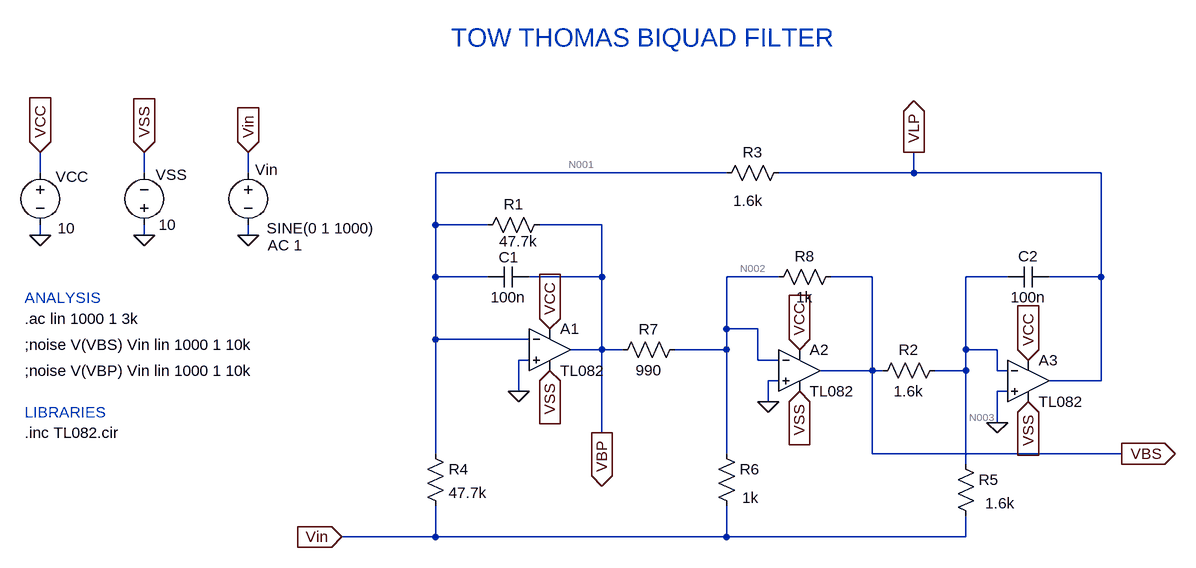
[diagram p0: schematic TTBiquad.asc]
TTBiquad.asc, the LTspice schematic file:
Version 4
SHEET 1 1612 680
WIRE -528 -96 -528 -128
WIRE -368 -96 -368 -128
WIRE -208 -96 -208 -128
WIRE 528 -96 80 -96
WIRE 816 -96 816 -128
WIRE 816 -96 608 -96
WIRE 1104 -96 816 -96
WIRE 80 -16 80 -96
WIRE 160 -16 80 -16
WIRE 336 -16 240 -16
WIRE -528 0 -528 -16
WIRE -368 0 -368 -16
WIRE -208 0 -208 -16
WIRE 80 64 80 -16
WIRE 160 64 80 64
WIRE 336 64 336 -16
WIRE 336 64 224 64
WIRE 608 64 528 64
WIRE 752 64 688 64
WIRE 960 64 896 64
WIRE 1104 64 1104 -96
WIRE 1104 64 1024 64
WIRE 528 144 528 64
WIRE 576 144 528 144
WIRE 80 160 80 64
WIRE 224 160 80 160
WIRE 256 160 256 144
WIRE 336 176 336 64
WIRE 336 176 288 176
WIRE 368 176 336 176
WIRE 528 176 528 144
WIRE 528 176 448 176
WIRE 896 176 896 64
WIRE 944 176 896 176
WIRE 224 192 208 192
WIRE 576 192 576 144
WIRE 608 192 576 192
WIRE 752 208 752 64
WIRE 752 208 672 208
WIRE 768 208 752 208
WIRE 896 208 896 176
WIRE 896 208 848 208
WIRE 944 208 944 176
WIRE 960 208 944 208
WIRE 608 224 592 224
WIRE 1104 224 1104 64
WIRE 1104 224 1024 224
WIRE 208 240 208 192
WIRE 960 240 944 240
WIRE 592 256 592 224
WIRE 944 288 944 240
WIRE 336 304 336 176
WIRE 80 336 80 160
WIRE 528 336 528 176
WIRE 752 336 752 208
WIRE 1136 336 752 336
WIRE 896 352 896 208
WIRE 80 464 80 416
WIRE 80 464 -64 464
WIRE 528 464 528 416
WIRE 528 464 80 464
WIRE 896 464 896 432
WIRE 896 464 528 464
FLAG 592 256 0
FLAG 944 288 0
FLAG -208 -128 Vin
IOPIN -208 -128 In
FLAG -368 -128 VSS
IOPIN -368 -128 In
FLAG -528 -128 VCC
IOPIN -528 -128 In
FLAG -528 0 0
FLAG -368 0 0
FLAG -208 0 0
FLAG 208 240 0
FLAG -64 464 Vin
IOPIN -64 464 In
FLAG 640 176 VCC
IOPIN 640 176 In
FLAG 992 192 VCC
IOPIN 992 192 In
FLAG 256 208 VSS
IOPIN 256 208 In
FLAG 640 240 VSS
IOPIN 640 240 In
FLAG 992 256 VSS
IOPIN 992 256 In
FLAG 256 144 VCC
IOPIN 256 144 In
FLAG 1136 336 VBS
IOPIN 1136 336 Out
FLAG 336 304 VBP
IOPIN 336 304 Out
FLAG 816 -128 VLP
IOPIN 816 -128 Out
SYMBOL Opamps\\opamp2 256 112 R0
SYMATTR InstName A1
SYMATTR Value TL082
SYMBOL Opamps\\opamp2 640 144 R0
SYMATTR InstName A2
SYMATTR Value TL082
SYMBOL Opamps\\opamp2 992 160 R0
SYMATTR InstName A3
SYMATTR Value TL082
SYMBOL res 624 -112 R90
WINDOW 0 0 56 VBottom 2
WINDOW 3 43 63 VTop 2
SYMATTR InstName R3
SYMATTR Value 1.6k
SYMATTR SpiceLine tol=1 pwr=0.1
SYMBOL voltage -208 -112 R0
WINDOW 123 30 127 Left 2
WINDOW 39 0 0 Left 0
WINDOW 0 11 11 Left 2
WINDOW 3 28 101 Left 2
SYMATTR Value2 AC 1
SYMATTR InstName Vin
SYMATTR Value SINE(0 1 1000)
SYMBOL voltage -528 -112 R0
WINDOW 123 0 0 Left 0
WINDOW 39 0 0 Left 0
WINDOW 0 24 22 Left 2
WINDOW 3 27 101 Left 2
SYMATTR InstName VCC
SYMATTR Value 10
SYMBOL res 64 320 R0
SYMATTR InstName R4
SYMATTR Value 47.7k
SYMATTR SpiceLine tol=1 pwr=0.1
SYMBOL res 512 320 R0
WINDOW 3 40 84 Left 2
SYMATTR Value 1k
SYMATTR InstName R6
SYMBOL res 880 336 R0
WINDOW 3 46 76 Left 2
SYMATTR Value 1.6k
SYMATTR InstName R5
SYMBOL res 256 -32 R90
WINDOW 0 0 56 VBottom 2
WINDOW 3 41 19 VRight 2
SYMATTR InstName R1
SYMATTR Value 47.7k
SYMATTR SpiceLine tol=1 pwr=0.1
SYMBOL res 704 48 R90
WINDOW 0 0 56 VBottom 2
WINDOW 3 32 56 VTop 2
SYMATTR InstName R8
SYMATTR Value 1k
SYMBOL res 864 192 R90
WINDOW 0 0 56 VBottom 2
WINDOW 3 32 56 VTop 2
SYMATTR InstName R2
SYMATTR Value 1.6k
SYMBOL res 464 160 R90
WINDOW 0 0 56 VBottom 2
WINDOW 3 32 56 VTop 2
SYMATTR InstName R7
SYMATTR Value 990
SYMBOL cap 224 48 R90
WINDOW 0 -14 47 VLeft 2
WINDOW 3 32 32 VTop 2
SYMATTR InstName C1
SYMATTR Value 100n
SYMBOL cap 1024 48 R90
WINDOW 0 0 32 VBottom 2
WINDOW 3 32 32 VTop 2
SYMATTR InstName C2
SYMATTR Value 100n
SYMBOL voltage -368 0 R180
WINDOW 0 -65 93 Left 2
WINDOW 3 -49 16 Left 2
SYMATTR InstName VSS
SYMATTR Value 10
TEXT -552 304 Left 2 !.inc TL082.cir
TEXT -552 128 Left 2 !.ac lin 1000 1 3k
TEXT 104 -304 Left 4 ;TOW THOMAS BIQUAD FILTER
TEXT -552 272 Left 2 ;LIBRARIES
TEXT -552 96 Left 2 ;ANALYSIS
TEXT -552 168 Left 2 !;noise V(VBS) Vin lin 1000 1 10k
TEXT -552 208 Left 2 !;noise V(VBP) Vin lin 1000 1 10k

The netlist it stands for:
* TTBiquad.asc
XA1 0 N001 VCC VSS VBP TL082  ; pins In+ In- V+ V- OUT
XA2 0 N002 VCC VSS VBS TL082  ; pins In+ In- V+ V- OUT
XA3 0 N003 VCC VSS VLP TL082  ; pins In+ In- V+ V- OUT
R3 VLP N001 1.6k tol=1 pwr=0.1
Vin Vin 0 SINE(0 1 1000) AC 1
VCC VCC 0 10
R4 N001 Vin 47.7k tol=1 pwr=0.1
R6 N002 Vin 1k
R5 N003 Vin 1.6k
R1 VBP N001 47.7k tol=1 pwr=0.1
R8 VBS N002 1k
R2 N003 VBS 1.6k
R7 N002 VBP 990
C1 VBP N001 100n
C2 VLP N003 100n
VSS 0 VSS 10
.inc TL082.cir
.ac lin 1000 1 3k
* TOW THOMAS BIQUAD FILTER
* LIBRARIES
* ANALYSIS
;noise V(VBS) Vin lin 1000 1 10k
;noise V(VBP) Vin lin 1000 1 10k
.backanno
.end

* Results of the author's LTspice run, read from the files saved beside the schematic
* Operating Point, zero values left out:
*   V(vbp) = 10.95 µV
*   V(vss) = -10 V
*   V(vcc) = 10 V
*   V(n001) = 10.97 µV
*   V(vbs) = 22.01 µV
*   V(n002) = 10.97 µV
*   V(vlp) = 11.4 µV
*   V(n003) = 10.97 µV
*   I(R7) = 24.17 pA
*   I(R2) = -6.897 nA
*   I(R8) = 11.03 nA
*   I(R5) = 6.857 nA
*   I(R6) = 10.97 nA
*   I(R4) = 230 pA
*   I(R3) = 270.5 pA
*   I(Vss) = -28.58 mA
*   I(Vcc) = -28.58 mA
*   I(Vin) = 18.06 nA
*   Ix(a1:1) = 40.05 pA
*   Ix(a1:2) = 40.05 pA
*   Ix(a1:3) = 9.528 mA
*   Ix(a1:4) = -9.528 mA
*   Ix(a1:5) = 24.67 pA
*   Ix(a2:1) = 40.05 pA
*   Ix(a2:2) = 40.05 pA
*   Ix(a2:3) = 9.528 mA
*   Ix(a2:4) = -9.528 mA
*   Ix(a2:5) = -17.93 nA
*   Ix(a3:1) = 40.05 pA
*   Ix(a3:2) = 40.05 pA
*   Ix(a3:3) = 9.528 mA
*   Ix(a3:4) = -9.528 mA
*   Ix(a3:5) = -270.5 pA
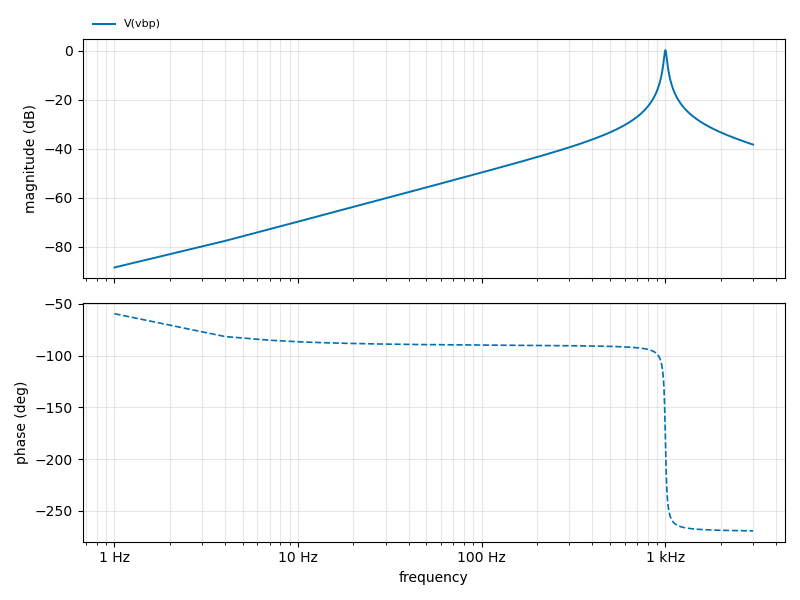
[diagram p1: AC Analysis of TTBiquad.asc, plotted from the saved traces]
* AC Analysis, 1 run:
*   V(vbp): -88.52 dB at 1 Hz, -38.34 dB at 3 kHz, peak 0.16 dB at 1.001 kHz, 3 dB below the peak at 983.5 Hz and 1.015 kHz